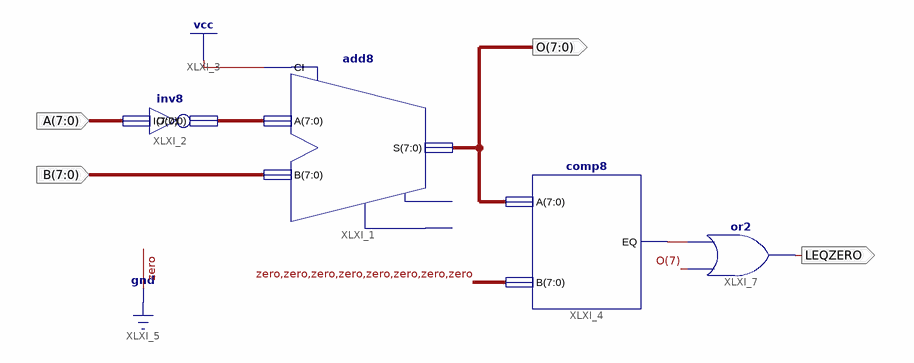
[diagram p0: schematic sheet 1]
// Xilinx ISE schematic alu.sch (spartan3e) as structural Verilog: 4 symbols, 4 ports
module alu (
  input  [7:0] B,
  input  [7:0] A,
  output LEQZERO,
  output [7:0] O
);

  wire XLXN_14;
  wire [7:0] XLXN_17;

  add8 XLXI_1 (.A(XLXN_17), .B(B), .CI(1'b1), .S(O));  // open: CO, OFL
  comp8 XLXI_4 (.A(O), .B({8{1'b0}}), .EQ(XLXN_14));
  or XLXI_7 (LEQZERO, O[7], XLXN_14);
  inv8 XLXI_2 (.I(A), .O(XLXN_17));
endmodule
